# Altium schematic sheet 05_LensControl.SchDoc
size A4; SheetNumber: 5; SheetTotal: 5
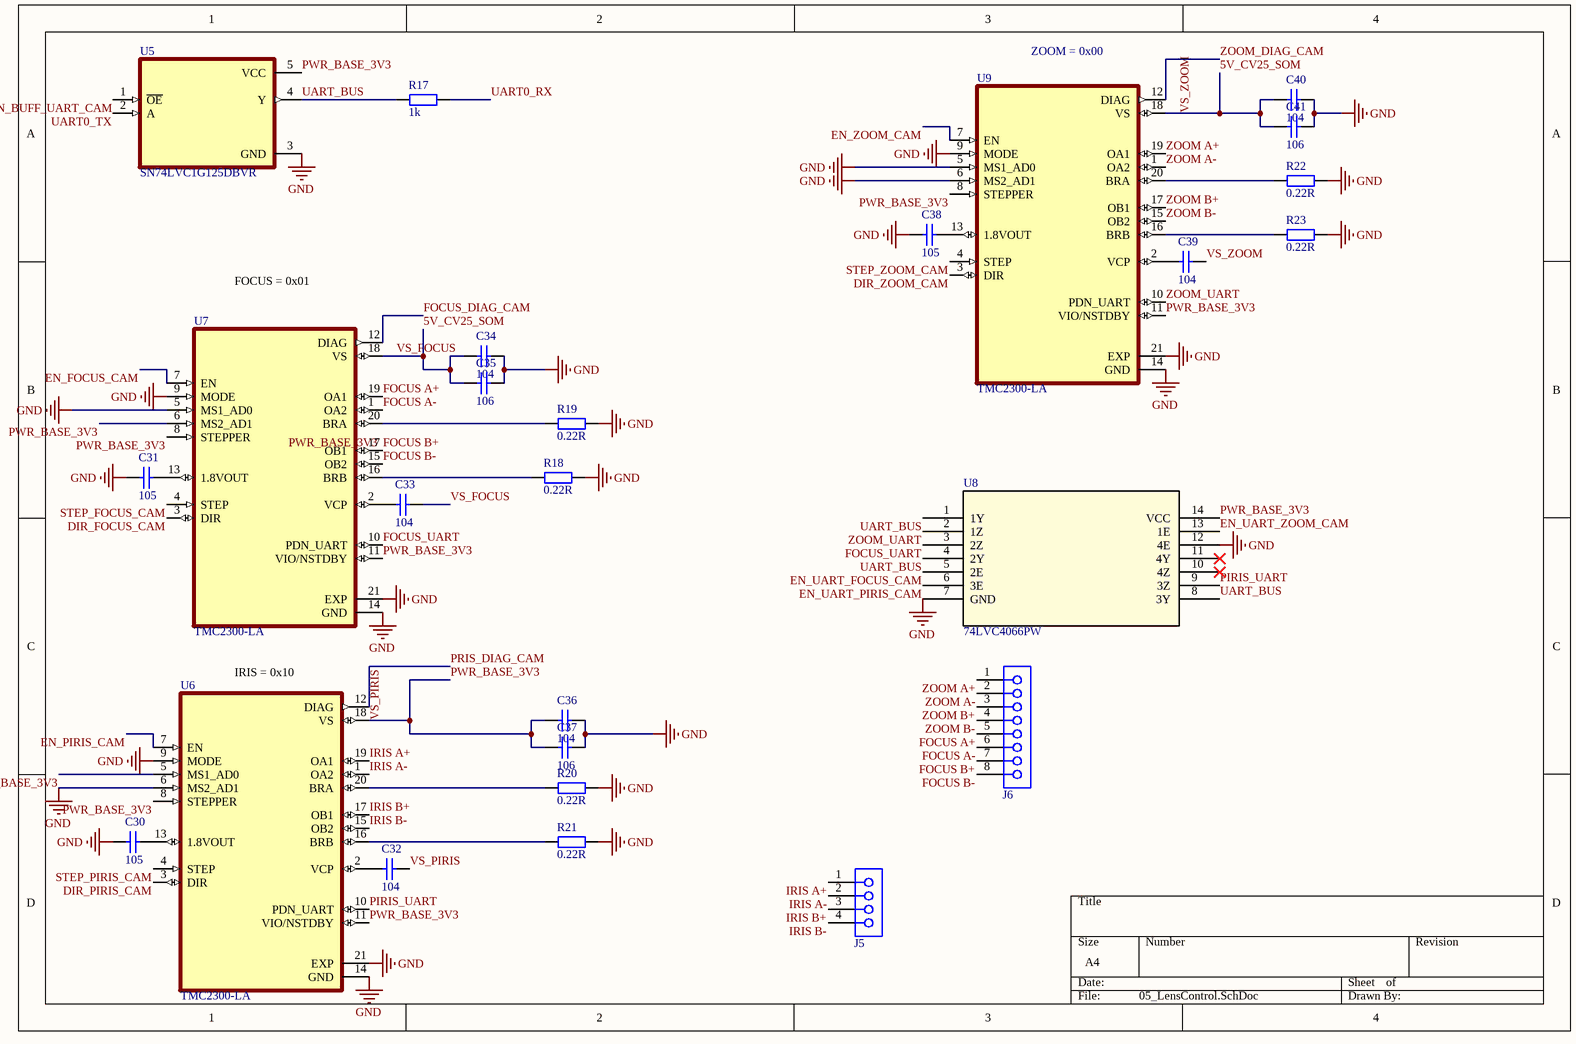
[diagram p0: 05_LensControl.SchDoc]

## Parts
C30  105  [tu 0805]
C31  105  [tu 0805]
C32  104  [tu 1206]
C33  104  [tu 1206]
C34  104  [tu 1206]
C35  106  [tu 0805]
C36  104  [tu 1206]
C37  106  [tu 0805]
C38  105  [tu 0805]
C39  104  [tu 1206]
C40  104  [tu 1206]
C41  106  [tu 0805]
J5  61000411921  [61000411921]  (value not drawn)
J6  61000811921  [61000811921]  (value not drawn)
R17  1k  [tro smd 1206]
R18  0.22R  [tro smd 0805]
R19  0.22R  [tro smd 0805]
R20  0.22R  [tro smd 0805]
R21  0.22R  [tro smd 0805]
R22  0.22R  [tro smd 0805]
R23  0.22R  [tro smd 0805]
U5  SN74LVC1G125DBVR  [SOT95P280X145-5N]
U6  TMC2300-LA  [QFN40P300X300X90-21N]
U7  TMC2300-LA  [QFN40P300X300X90-21N]
U8  74LVC4066PW  [SOT402-1_NXP]
U9  TMC2300-LA  [QFN40P300X300X90-21N]

## Nets
GND: C30.2 C31.2 C34.1 C35.1 C36.1 C37.1 C38.2 C40.1 C41.1 R18.2 R19.2 R20.2 R21.2 R22.2 R23.2 U5.3(GND) U6.6(MS2_AD1) U6.9(MODE) U6.14(GND) U6.21(EXP) U7.5(MS1_AD0) U7.9(MODE) U7.14(GND) U7.21(EXP) U8.7(GND) U8.12(4E) U9.5(MS1_AD0) U9.6(MS2_AD1) U9.9(MODE) U9.14(GND) U9.21(EXP)
5V_CV25_SOM: C33.2 C34.2 C35.2 C39.2 C40.2 C41.2 U7.18(VS) U9.18(VS)  [also labelled VS_FOCUS, VS_ZOOM]
DIR_FOCUS_CAM: U7.3(DIR)
DIR_PIRIS_CAM: U6.3(DIR)
DIR_ZOOM_CAM: U9.3(DIR)
EN_BUFF_UART_CAM: U5.1(~{OE})
EN_FOCUS_CAM: U7.7(EN)
EN_PIRIS_CAM: U6.7(EN)
EN_UART_FOCUS_CAM: U8.5(2E)
EN_UART_PIRIS_CAM: U8.6(3E)
EN_UART_ZOOM_CAM: U8.13(1E)
EN_ZOOM_CAM: U9.7(EN)
FOCUS A+: J6.5 U7.19(OA1)
FOCUS A-: J6.6 U7.1(OA2)
FOCUS B+: J6.7 U7.17(OB1)
FOCUS B-: J6.8 U7.15(OB2)
FOCUS_DIAG_CAM: U7.12(DIAG)
FOCUS_UART: U7.10(PDN_UART) U8.3(2Z)
IRIS A+: J5.1 U6.19(OA1)
IRIS A-: J5.2 U6.1(OA2)
IRIS B+: J5.3 U6.17(OB1)
IRIS B-: J5.4 U6.15(OB2)
PIRIS_UART: U6.10(PDN_UART) U8.9(3Z)
PRIS_DIAG_CAM: U6.12(DIAG)
PWR_BASE_3V3: C32.2 C36.2 C37.2 U5.5(VCC) U6.5(MS1_AD0) U6.8(STEPPER) U6.11(VIO/NSTDBY) U6.18(VS) U7.6(MS2_AD1) U7.8(STEPPER) U7.11(VIO/NSTDBY) U8.14(VCC) U9.8(STEPPER) U9.11(VIO/NSTDBY)  [also labelled VS_PIRIS]
STEP_FOCUS_CAM: U7.4(STEP)
STEP_PIRIS_CAM: U6.4(STEP)
STEP_ZOOM_CAM: U9.4(STEP)
UART0_RX: R17.2
UART0_TX: U5.2(A)
UART_BUS: R17.1 U5.4(Y) U8.1(1Y) U8.4(2Y) U8.8(3Y)
ZOOM A+: J6.1 U9.19(OA1)
ZOOM A-: J6.2 U9.1(OA2)
ZOOM B+: J6.3 U9.17(OB1)
ZOOM B-: J6.4 U9.15(OB2)
ZOOM_DIAG_CAM: U9.12(DIAG)
ZOOM_UART: U8.2(1Z) U9.10(PDN_UART)
NetC30_1: C30.1 U6.13(1.8VOUT)
NetC31_1: C31.1 U7.13(1.8VOUT)
NetC32_1: C32.1 U6.2(VCP)
NetC33_1: C33.1 U7.2(VCP)
NetC38_1: C38.1 U9.13(1.8VOUT)
NetC39_1: C39.1 U9.2(VCP)
NetR18_1: R18.1 U7.16(BRB)
NetR19_1: R19.1 U7.20(BRA)
NetR20_1: R20.1 U6.20(BRA)
NetR21_1: R21.1 U6.16(BRB)
NetR22_1: R22.1 U9.20(BRA)
NetR23_1: R23.1 U9.16(BRB)

Not connected (* = marked no-connect by the designer): U8 10(4Z)* 11(4Y)*

## Notes on the sheet
- (near U9) ZOOM = 0x00
- FOCUS = 0x01
- (near U6) IRIS = 0x10
- Labels drawn without touching a wire or pin: PWR_BASE_3V3

## Library data of the parts
C30 C31 C38 = Tu 0805 105 50V 10%: Dán; Don_Vi: Con; So_Chan: 2; Ten_Linh_Kien: Tụ 0805 105-1uF 10% 50V; Ma_Hang: MH004552; Chung_Loai: Dán; Kieu_Chan: *
C32-C34 C36 C39 C40 = Tu 1206 104 50V 20%: Dán; Don_Vi: Con; So_Chan: 2; Ten_Linh_Kien: Tụ 1206 104-0.1uF 20% 50V; Ma_Hang: MH004544; Chung_Loai: Dán; Kieu_Chan: *
C35 C37 C41 = Tu 0805 106 16V 10%: Dán; Ten_Linh_Kien: Tụ 0805 106-10uF 10% 16V; So_Chan: 2; Don_Vi: Con; Ma_Hang: MH004553; Chung_Loai: Dán; Kieu_Chan: *
J5 = 61000411921: WR-PHD Socket Header, SMT, Vertical, pitch 2.54mm, 1 Row, 4P; Manufacturer: Wurth Elektronik; Contact Resistance: 20mOhm; Rated Current: 3A; Working Voltage: 250V; Withstanding Voltage: 500V; Manufacturer Part Number: 61000411921; Category: Board-to-Board Connectors; Match Code: WR-PHD; ComponentLink1Description: Website Link; ComponentLink1URL: https://www.we-online.com/redexpert/article/61000411921?ad; ComponentLink2Description: Datasheet Link; ComponentLink2URL: https://www.we-online.com/redexpert/spec/61000411921?ad; Mount: Surface Mount; Operating Temperature Max: 105°C; Operating Temperature Min: -40°C; Packaging: Tube; Gender: Socket Header; Number of Pins: 4; Number of Rows: 1; Orientation: Vertical; Pitch: 2.54mm
J6 = 61000811921: WR-PHD Socket Header, SMT, Vertical, pitch 2.54mm, 1 Row, 8P; Manufacturer: Wurth Elektronik; Contact Resistance: 20mOhm; Rated Current: 3A; Working Voltage: 250V; Withstanding Voltage: 500V; Manufacturer Part Number: 61000811921; Category: Board-to-Board Connectors; Match Code: WR-PHD; ComponentLink1Description: Website Link; ComponentLink1URL: https://www.we-online.com/redexpert/article/61000811921?ad; ComponentLink2Description: Datasheet Link; ComponentLink2URL: https://www.we-online.com/redexpert/spec/61000811921?ad; Mount: Surface Mount; Operating Temperature Max: 105°C; Operating Temperature Min: -40°C; Packaging: Tube; Gender: Socket Header; Number of Pins: 8; Number of Rows: 1; Orientation: Vertical; Pitch: 2.54mm
R17 = Tro 1206 1% 1k: Dán; Don_Vi: Con; So_Chan: 2; Ten_Linh_Kien: Trở 1206 1% 1k; Ma_Hang: MH005880; Chung_Loai: Dán; Kieu_Chan: *
R18-R23 = Tro 0805 1% 0.22R: Dán; Don_Vi: Con; So_Chan: 2; Ten_Linh_Kien: Trở 0805 1% 0.22R; Ma_Hang: MH005466; Chung_Loai: Dán; Kieu_Chan: *
U5 = SN74LVC1G125DBVR: Single 1.65-V to 5.5-V buffer with 3-state outputs; MF: Texas Instruments; SnapEDA_Link: https://www.snapeda.com/parts/SN74LVC1G125DBVR/Texas+Instruments/view-part/?ref=snap; Package: SOT-23-5 Texas Instruments; Value: *; MP: SN74LVC1G125DBVR; Check_prices: https://www.snapeda.com/parts/SN74LVC1G125DBVR/Texas+Instruments/view-part/?ref=eda
U6 U7 U9 = TMC2300-LA: Maxim Low Voltage Stepper Motor Driver IC, Step/Dir, UART, 2-11V Supply, 1.2A, QFN20; MF: Maxim Integrated; Package: None; Availability: In Stock; SnapEDA_Link: https://www.snapeda.com/parts/TMC2300-LA/Maxim+Integrated/view-part/?ref=snap; MP: TMC2300-LA; Price: None; Check_prices: https://www.snapeda.com/parts/TMC2300-LA/Maxim+Integrated/view-part/?ref=eda; Value: *
U8 = 74LVC4066PW: Description; Manufacturer_Name: NXP; Copyright: Copyright (C) 2026 Ultra Librarian. All rights reserved.; Manufacturer_Part_Number: 74LVC4066PW; RefDes: RefDes; Type: Type